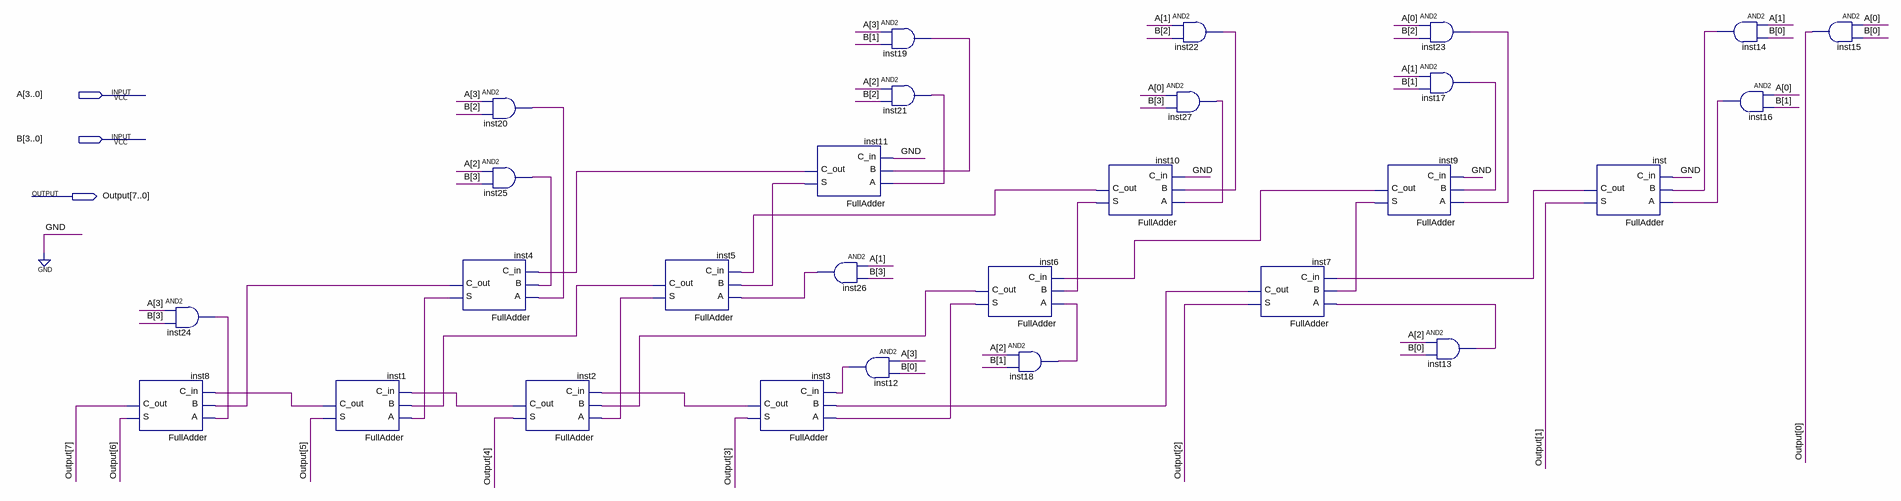
[diagram p0: schematic sheet]
// Quartus schematic Multiplier2.bdf as structural Verilog: 28 symbols, 3 pins
module Multiplier2 (
  input  [3:0] A,
  input  [3:0] B,
  output [7:0] Output
);

  wire inst1_c_out, inst2_c_out, inst3_c_out, inst4_c_out, inst4_s, inst5_c_out, inst5_s, inst6_c_out,
       inst6_s, inst7_c_out, inst9_c_out, inst9_s, inst10_c_out, inst10_s, inst11_c_out, inst11_s,
       inst12_out, inst13_out, inst14_out, inst16_out, inst17_out, inst18_out, inst19_out, inst20_out,
       inst21_out, inst22_out, inst23_out, inst24_out, inst25_out, inst26_out, inst27_out, inst_c_out;

  FullAdder inst8 (.A(inst24_out), .B(inst4_c_out), .C_in(inst1_c_out), .S(Output[6]), .C_out(Output[7]));
  and inst24 (inst24_out, A[3], B[3]);
  FullAdder inst1 (.A(inst4_s), .B(inst5_c_out), .C_in(inst2_c_out), .S(Output[5]), .C_out(inst1_c_out));
  and inst20 (inst20_out, A[3], B[2]);
  and inst25 (inst25_out, A[2], B[3]);
  FullAdder inst4 (.A(inst20_out), .B(inst25_out), .C_in(inst11_c_out), .S(inst4_s), .C_out(inst4_c_out));
  FullAdder inst2 (.A(inst5_s), .B(inst6_c_out), .C_in(inst3_c_out), .S(Output[4]), .C_out(inst2_c_out));
  FullAdder inst5 (.A(inst26_out), .B(inst11_s), .C_in(inst10_c_out), .S(inst5_s), .C_out(inst5_c_out));
  FullAdder inst3 (.A(inst6_s), .B(inst7_c_out), .C_in(inst12_out), .S(Output[3]), .C_out(inst3_c_out));
  FullAdder inst11 (.A(inst21_out), .B(inst19_out), .C_in(1'b0), .S(inst11_s), .C_out(inst11_c_out));
  and inst26 (inst26_out, A[1], B[3]);
  and inst12 (inst12_out, A[3], B[0]);
  and inst19 (inst19_out, A[3], B[1]);
  and inst21 (inst21_out, A[2], B[2]);
  FullAdder inst6 (.A(inst18_out), .B(inst10_s), .C_in(inst9_c_out), .S(inst6_s), .C_out(inst6_c_out));
  and inst18 (inst18_out, A[2], B[1]);
  FullAdder inst10 (.A(inst27_out), .B(inst22_out), .C_in(1'b0), .S(inst10_s), .C_out(inst10_c_out));
  and inst22 (inst22_out, A[1], B[2]);
  and inst27 (inst27_out, A[0], B[3]);
  FullAdder inst7 (.A(inst13_out), .B(inst9_s), .C_in(inst_c_out), .S(Output[2]), .C_out(inst7_c_out));
  FullAdder inst9 (.A(inst23_out), .B(inst17_out), .C_in(1'b0), .S(inst9_s), .C_out(inst9_c_out));
  and inst23 (inst23_out, A[0], B[2]);
  and inst17 (inst17_out, A[1], B[1]);
  and inst13 (inst13_out, A[2], B[0]);
  FullAdder inst (.A(inst16_out), .B(inst14_out), .C_in(1'b0), .S(Output[1]), .C_out(inst_c_out));
  and inst14 (inst14_out, A[1], B[0]);
  and inst16 (inst16_out, A[0], B[1]);
  and inst15 (Output[0], A[0], B[0]);
endmodule
